# Altium schematic sheet ESP32花盆.schdoc
size 429 x 307 mm
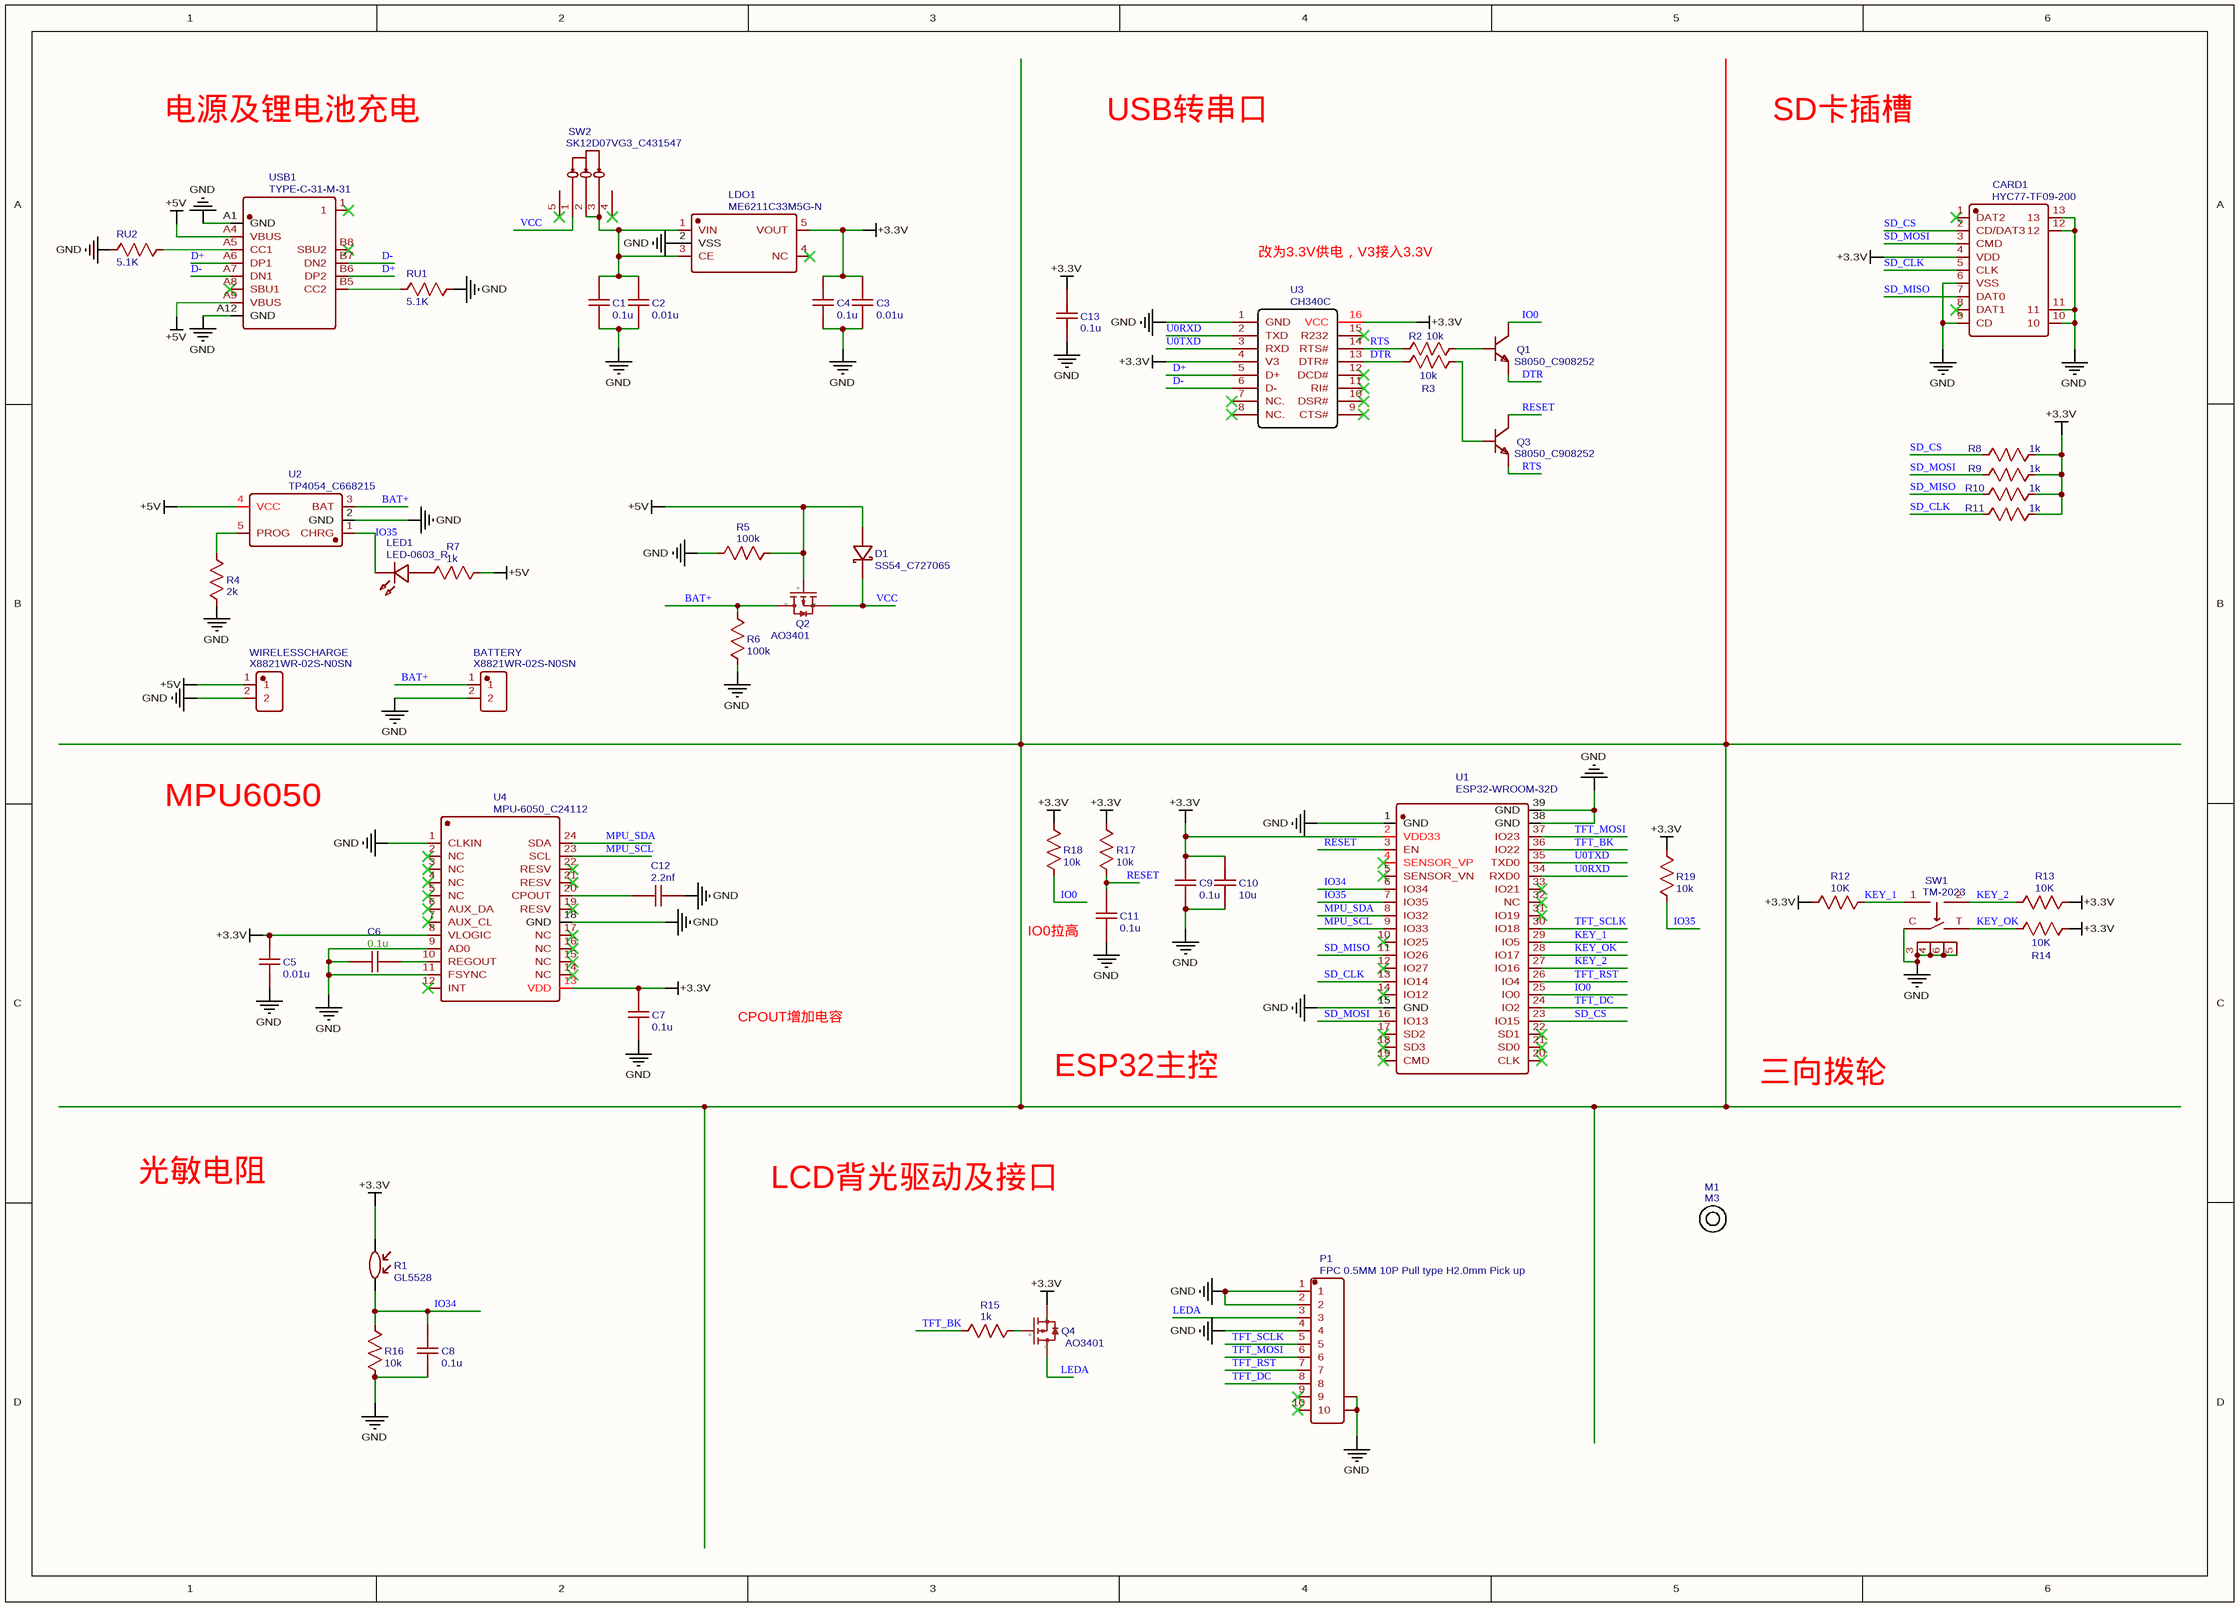
[diagram p0: ESP32花盆.schdoc]

## Parts
BATTERY  X8821WR-02S-N0SN  [CONN-TH_X8821WR-02S-N0SN]
C1  0.1u  [C0603]
C2  0.01u  [C0603]
C3  0.01u  [C0603]
C4  0.1u  [C0603]
C5  0.01u  [C0603]
C6  0.1u  [C0603]
C7  0.1u  [C0603]
C8  0.1u  [C0603]
C9  0.1u  [C0603]
C10  10u  [C0603]
C11  0.1u  [C0603]
C12  2.2nf  [C0603]
C13  0.1u  [C0603]
CARD1  HYC77-TF09-200  [TF-SMD_HYC77-TF09-200]
D1  SS54_C727065  [SMA_L4.3-W2.6-LS5.0-RD]
LDO1  ME6211C33M5G-N  [SOT-23-5_L3.0-W1.7-P0.95-LS2.8-BR]
LED1  LED-0603_R  [LED0603_RED]
M1  M3  [M3]
P1  FPC 0.5MM 10P Pull type H2.0mm Pick up  [FPC-SMD_FPC0.5MM10P]
Q1  S8050_C908252  [SOT-23-3_L2.9-W1.3-P1.90-LS2.4-BR]
Q2  AO3401  [SOT-23-3_L2.9-W1.3-P1.90-LS2.4-BR]
Q3  S8050_C908252  [SOT-23-3_L2.9-W1.3-P1.90-LS2.4-BR]
Q4  AO3401  [SOT-23-3_L2.9-W1.3-P1.90-LS2.4-BR]
R1  GL5528  [RES-TH_L5.1-W4.3-P3.40-D0.5]
R2  10k  [R0603]
R3  10k  [R0603]
R4  2k  [R0603]
R5  100k  [R0603]
R6  100k  [R0603]
R7  1k  [R0603]
R8  1k  [R0603]
R9  1k  [R0603]
R10  1k  [R0603]
R11  1k  [R0603]
R12  10K  [R0603]
R13  10K  [R0603]
R14  10K  [R0603]
R15  1k  [R0603]
R16  10k  [R0603]
R17  10k  [R0603]
R18  10k  [R0603]
R19  10k  [R0603]
RU1  5.1K  [R0603]
RU2  5.1K  [R0603]
SW1  TM-2023  [SW-SMD_TM-2023-1]
SW2  SK12D07VG3_C431547  [SW-TH_SK12D07VG3]
U1  ESP32-WROOM-32D  [WIFIM-SMD_39P-L25.5-W18.0-P1.27-BL]
U2  TP4054_C668215  [SOT-23-5_L3.0-W1.7-P0.95-LS2.8-BL]
U3  CH340C  [SOP-16_L10.0-W3.9-P1.27-LS6.0-BL]
U4  MPU-6050_C24112  [QFN-24_L4.0-W4.0-P0.50-BL-MPU-6050]
USB1  TYPE-C-31-M-31  [USB-C-SMD_TYPE-C-31-M-31]
WIRELESSCHARGE  X8821WR-02S-N0SN  [CONN-TH_X8821WR-02S-N0SN]

## Nets
+3.3V: C3.2 C4.2 C5.1 C7.1 C9.2 C10.2 C13.2 CARD1.4(VDD) LDO1.5(VOUT) Q4.2(S) R1.1 R8.2 R9.2 R10.2 R11.2 R12.2 R13.1 R14.1 R17.2 R18.2 R19.2 U1.2(VDD33) U3.4(V3) U3.16(VCC) U4.8(VLOGIC) U4.13(VDD)
+5V: D1.2 Q2.1(G) R5.2 R7.2 U2.4(VCC) USB1.A4(VBUS) USB1.A9(VBUS) WIRELESSCHARGE.1
GND: BATTERY.2 C1.1 C2.1 C3.1 C4.1 C5.2 C6.2 C7.2 C8.1 C9.1 C10.1 C11.1 C12.2 C13.1 CARD1.6(VSS) CARD1.9(CD) CARD1.10 CARD1.11 CARD1.12 CARD1.13 LDO1.2(VSS) P1.1 P1.2 P1.4 P1.11 P1.12 R4.1 R5.1 R6.1 R16.1 RU1.1 RU2.2 SW1.3 SW1.4 SW1.5 SW1.6 SW1.C U1.1(GND) U1.15(GND) U1.38(GND) U1.39(GND) U2.2(GND) U3.1(GND) U4.1(CLKIN) U4.9(AD0) U4.11(FSYNC) U4.18(GND) USB1.A1(GND) USB1.A12(GND) WIRELESSCHARGE.2
BAT+: BATTERY.1 Q2.3(D) R6.2 U2.3(BAT)
D+: U3.5(D+) USB1.A6(DP1) USB1.B6(DP2)
D-: U3.6(D-) USB1.A7(DN1) USB1.B7(DN2)
DTR: Q1.2(E) R3.1 U3.13(DTR#)
IO0: Q1.3(C) R18.1 U1.25(IO0)
IO34: C8.2 R1.2 R16.2 U1.6(IO34)
IO35: LED1.2 R19.1 U1.7(IO35) U2.1(CHRG)
KEY_1: R12.1 SW1.1 U1.29(IO5)
KEY_2: R13.2 SW1.2 U1.27(IO16)
KEY_OK: R14.2 SW1.T U1.28(IO17)
LEDA: P1.3 Q4.3(D)
MPU_SCL: U1.9(IO33) U4.23(SCL)
MPU_SDA: U1.8(IO32) U4.24(SDA)
RESET: C11.2 Q3.3(C) R17.1 U1.3(EN)
RTS: Q3.2(E) R2.1 U3.14(RTS#)
SD_CLK: CARD1.5(CLK) R11.1 U1.13(IO14)
SD_CS: CARD1.2(CD/DAT3) R8.1 U1.23(IO15)
SD_MISO: CARD1.7(DAT0) R10.1 U1.11(IO26)
SD_MOSI: CARD1.3(CMD) R9.1 U1.16(IO13)
TFT_BK: R15.1 U1.36(IO22)
TFT_DC: P1.8 U1.24(IO2)
TFT_MOSI: P1.6 U1.37(IO23)
TFT_RST: P1.7 U1.26(IO4)
TFT_SCLK: P1.5 U1.30(IO18)
U0RXD: U1.34(RXD0) U3.2(TXD)
U0TXD: U1.35(TXD0) U3.3(RXD)
VCC: D1.1 Q2.2(S) SW2.1
NetC1_2: C1.2 C2.2 LDO1.1(VIN) LDO1.3(CE) SW2.2 SW2.3
NetC6_1: C6.1 U4.10(REGOUT)
NetC12_1: C12.1 U4.20(CPOUT)
NetLED1_1: LED1.1 R7.1
NetQ1_1: Q1.1(B) R2.2
NetQ3_1: Q3.1(B) R3.2
NetQ4_1: Q4.1(G) R15.2
NetR4_2: R4.2 U2.5(PROG)
NetRU1_2: RU1.2 USB1.B5(CC2)
NetRU2_1: RU2.1 USB1.A5(CC1)

Not connected (* = marked no-connect by the designer): CARD1 1(DAT2)* 8(DAT1)*; LDO1 4(NC)*; P1 9* 10*; SW2 4* 5*; U1 4(SENSOR_VP)* 5(SENSOR_VN)* 10(IO25)* 12(IO27)* 14(IO12)* 17(SD2)* 18(SD3)* 19(CMD)* 20(CLK)* 21(SD0)* 22(SD1)* 31(IO19)* 32(NC)* 33(IO21)*; U3 7(NC.)* 8(NC.)* 9(CTS#)* 10(DSR#)* 11(RI#)* 12(DCD#)* 15(R232)*; U4 2(NC)* 3(NC)* 4(NC)* 5(NC)* 6(AUX_DA)* 7(AUX_CL)* 12(INT)* 14(NC)* 15(NC)* 16(NC)* 17(NC)* 19(RESV)* 21(RESV)* 22(RESV)*; USB1 1* A8(SBU1)* B8(SBU2)*

## Notes on the sheet
- 电源及锂电池充电
- USB转串口
- SD卡插槽
- 改为3.3V供电，V3接入3.3V
- MPU6050
- IO0拉高
- CPOUT增加电容
- ESP32主控
- 三向拨轮
- 光敏电阻
- LCD背光驱动及接口

## Library data of the parts
BATTERY WIRELESSCHARGE = X8821WR-02S-N0SN: BOM_Manufacturer: XKB Enterprise; Contributor: LCSC; BOM_Supplier: LCSC; BOM_Supplier Part: C388739; BOM_Manufacturer Part: X8821WR-02S-N0SN; BOM_JLCPCB Part Class: Extended Part; spicePre: C; spiceSymbolName: X8821WR-02S-N0SN
C1 C4 C6-C9 C11 C13 = 0.1u: nameAlias: Value(F); Contributor: LCEDA_Lib; spicePre: C; spiceSymbolName: C_0603_US
C2 C3 C5 = 0.01u: nameAlias: Value(F); Contributor: LCEDA_Lib; spicePre: C; spiceSymbolName: C_0603_US
C10 = 10u: nameAlias: Value(F); Contributor: LCEDA_Lib; spicePre: C; spiceSymbolName: C_0603_US
C12 = 2.2nf: nameAlias: Value(F); Contributor: LCEDA_Lib; spicePre: C; spiceSymbolName: C_0603_US
CARD1 = HYC77-TF09-200: BOM_Manufacturer: 华宇创; Contributor: LCSC; BOM_Supplier: LCSC; BOM_Supplier Part: C341092; BOM_Manufacturer Part: HYC77-TF09-200; BOM_JLCPCB Part Class: Extended Part; spicePre: C; spiceSymbolName: HYC77-TF09-200
D1 = SS54_C727065: BOM_Manufacturer: TWGMC; BOM_Manufacturer Part: SS54; Contributor: LCSC; BOM_Supplier: LCSC; BOM_Supplier Part: C727065; BOM_JLCPCB Part Class: Extended Part; spicePre: D; spiceSymbolName: SS54_C727065
LDO1 = ME6211C33M5G-N: BOM_Manufacturer: MICRONE; BOM_Supplier: LCSC; BOM_Manufacturer Part: ME6211C33M5G-N; BOM_Supplier Part: C82942; BOM_JLCPCB Part Class: Extended Part; spicePre: L; spiceSymbolName: ME6211C33M5G-N
LED1 = LED-0603_R: BOM_Manufacturer: EVERLIGHT(台湾亿光); BOM_Manufacturer Part: 19-217/R6C-AL1M2VY/3T; Contributor: LCEDA_01; BOM_Supplier Part: C72044; BOM_Supplier: LCSC; spicePre: L; spiceSymbolName: LED-0603_R
M1 = M3: Contributor: MengYang; spicePre: M; spiceSymbolName: M3
P1 = FPC 0.5MM 10P Pull type H2.0mm Pick up: BOM_Manufacturer: BOOMELE; spicePre: X; BOM_Supplier: LCSC; BOM_Manufacturer Part: FPC 0.5MM 10P Pull type H2.0mm Pick up; BOM_Supplier Part: C11085; BOM_JLCPCB Part Class: Extended Part; spiceSymbolName: FPC 0.5MM 10P Pull type H2.0mm Pick up
Q1 Q3 = S8050_C908252: BOM_Manufacturer: FUXINSEMI; BOM_Manufacturer Part: S8050; Contributor: LCSC; BOM_Supplier: LCSC; BOM_Supplier Part: C908252; BOM_JLCPCB Part Class: Extended Part; spicePre: Q; spiceSymbolName: S8050_C908252
Q2 Q4 = AO3401: BOM_Manufacturer: Hottech; Contributor: LCSC; BOM_Supplier: LCSC; BOM_Manufacturer Part: AO3401; BOM_Supplier Part: C181091; BOM_JLCPCB Part Class: Extended Part; spicePre: Q; spiceSymbolName: AO3401
R1 = GL5528: BOM_Manufacturer: Senba; BOM_Supplier: LCSC; BOM_Manufacturer Part: GL5528; BOM_Supplier Part: C125627; BOM_JLCPCB Part Class: Extended Part; spicePre: R; spiceSymbolName: GL5528
R2 R3 R16-R19 = 10k: nameAlias: Value(Ω); Contributor: LCEDA_Lib; spicePre: R; spiceSymbolName: R_0603_US
R4 = 2k: nameAlias: Value(Ω); Contributor: LCEDA_Lib; spicePre: R; spiceSymbolName: R_0603_US
R5 R6 RU1 RU2 = 100k: nameAlias: Value(Ω); Contributor: LCEDA_Lib; spicePre: R; spiceSymbolName: R_0603_US
R7-R11 R15 = 1k: nameAlias: Value(Ω); Contributor: LCEDA_Lib; spicePre: R; spiceSymbolName: R_0603_US
R12-R14 = 10K: nameAlias: Value(Ω); Contributor: LCEDA_Lib; spicePre: R; spiceSymbolName: R_0603_US
SW1 = TM-2023: BOM_Manufacturer: XKB Enterprise; Contributor: LCSC; BOM_Supplier: LCSC; BOM_Supplier Part: C318951; BOM_Manufacturer Part: TM-2023; BOM_JLCPCB Part Class: Extended Part; spicePre: S; spiceSymbolName: TM-2023
SW2 = SK12D07VG3_C431547: BOM_Manufacturer: SHOU HAN; Contributor: LCSC; BOM_Supplier: LCSC; BOM_Supplier Part: C431547; BOM_Manufacturer Part: SK12D07VG3; BOM_JLCPCB Part Class: Extended Part; spicePre: S; spiceSymbolName: SK12D07VG3_C431547
U1 = ESP32-WROOM-32D: BOM_Manufacturer: ESPRESSIF 乐鑫; Contributor: LCSC; BOM_Supplier: LCSC; BOM_Supplier Part: C473012; BOM_Manufacturer Part: ESP32-WROOM-32D; BOM_JLCPCB Part Class: Extended Part; spicePre: U; spiceSymbolName: ESP32-WROOM-32D
U2 = TP4054_C668215: BOM_Manufacturer: UMW(Youtai Semiconductor Co., Ltd.); BOM_Manufacturer Part: TP4054; Contributor: LCSC; BOM_Supplier: LCSC; BOM_Supplier Part: C668215; BOM_JLCPCB Part Class: Extended Part; spicePre: U; spiceSymbolName: TP4054_C668215
U3 = CH340C: BOM_Manufacturer: WCH; BOM_Supplier: LCSC; BOM_Manufacturer Part: CH340C; BOM_Supplier Part: C84681; BOM_JLCPCB Part Class: Extended Part; spicePre: U; spiceSymbolName: CH340C
U4 = MPU-6050_C24112: BOM_Manufacturer: InvenSense; sourceId: 1T5FDZYC8; timeStamp: 1462265206; BOM_Supplier: LCSC; BOM_Manufacturer Part: MPU-6050; BOM_Supplier Part: C24112; BOM_JLCPCB Part Class: Basic Part; spicePre: U; spiceSymbolName: MPU-6050_C24112
USB1 = TYPE-C-31-M-31: BOM_Manufacturer: 韩国韩荣; Contributor: LCSC; BOM_Supplier: LCSC; BOM_Supplier Part: C2760486; BOM_Manufacturer Part: TYPE-C-31-M-31; JLCPCB Part Class: Extended Part; BOM_JLCPCB Part Class: Extended Part; spicePre: U; spiceSymbolName: TYPE-C-31-M-31